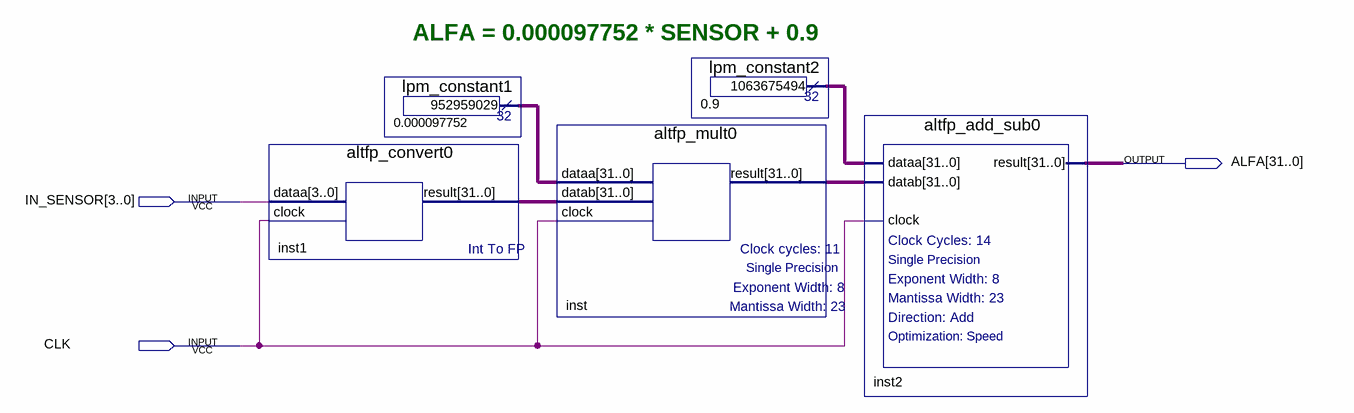
[diagram p0: schematic sheet]
// Quartus schematic alfa.bdf as structural Verilog: 5 symbols, 3 pins
module alfa (
  input  [3:0] IN_SENSOR,
  input  CLK,
  output [31:0] ALFA
);

  wire [31:0] inst1_result, inst_result, n0_9_result, n0_000097752_result;

  altfp_convert0 inst1 (.dataa(IN_SENSOR), .clock(CLK), .result(inst1_result));
  lpm_constant1 \u_0.000097752  (.result(n0_000097752_result));
  altfp_mult0 inst (.clock(CLK), .dataa(n0_000097752_result), .datab(inst1_result), .result(inst_result));
  lpm_constant2 \u_0.9  (.result(n0_9_result));
  altfp_add_sub0 inst2 (.dataa(n0_9_result), .datab(inst_result), .clock(CLK), .result(ALFA));

  // Notes on the sheet:
  //   ALFA = 0.000097752 * SENSOR + 0.9
endmodule
